# EAGLE schematic bc-module-power (EAGLE 7.7.0)

## Sheet 1 of 2
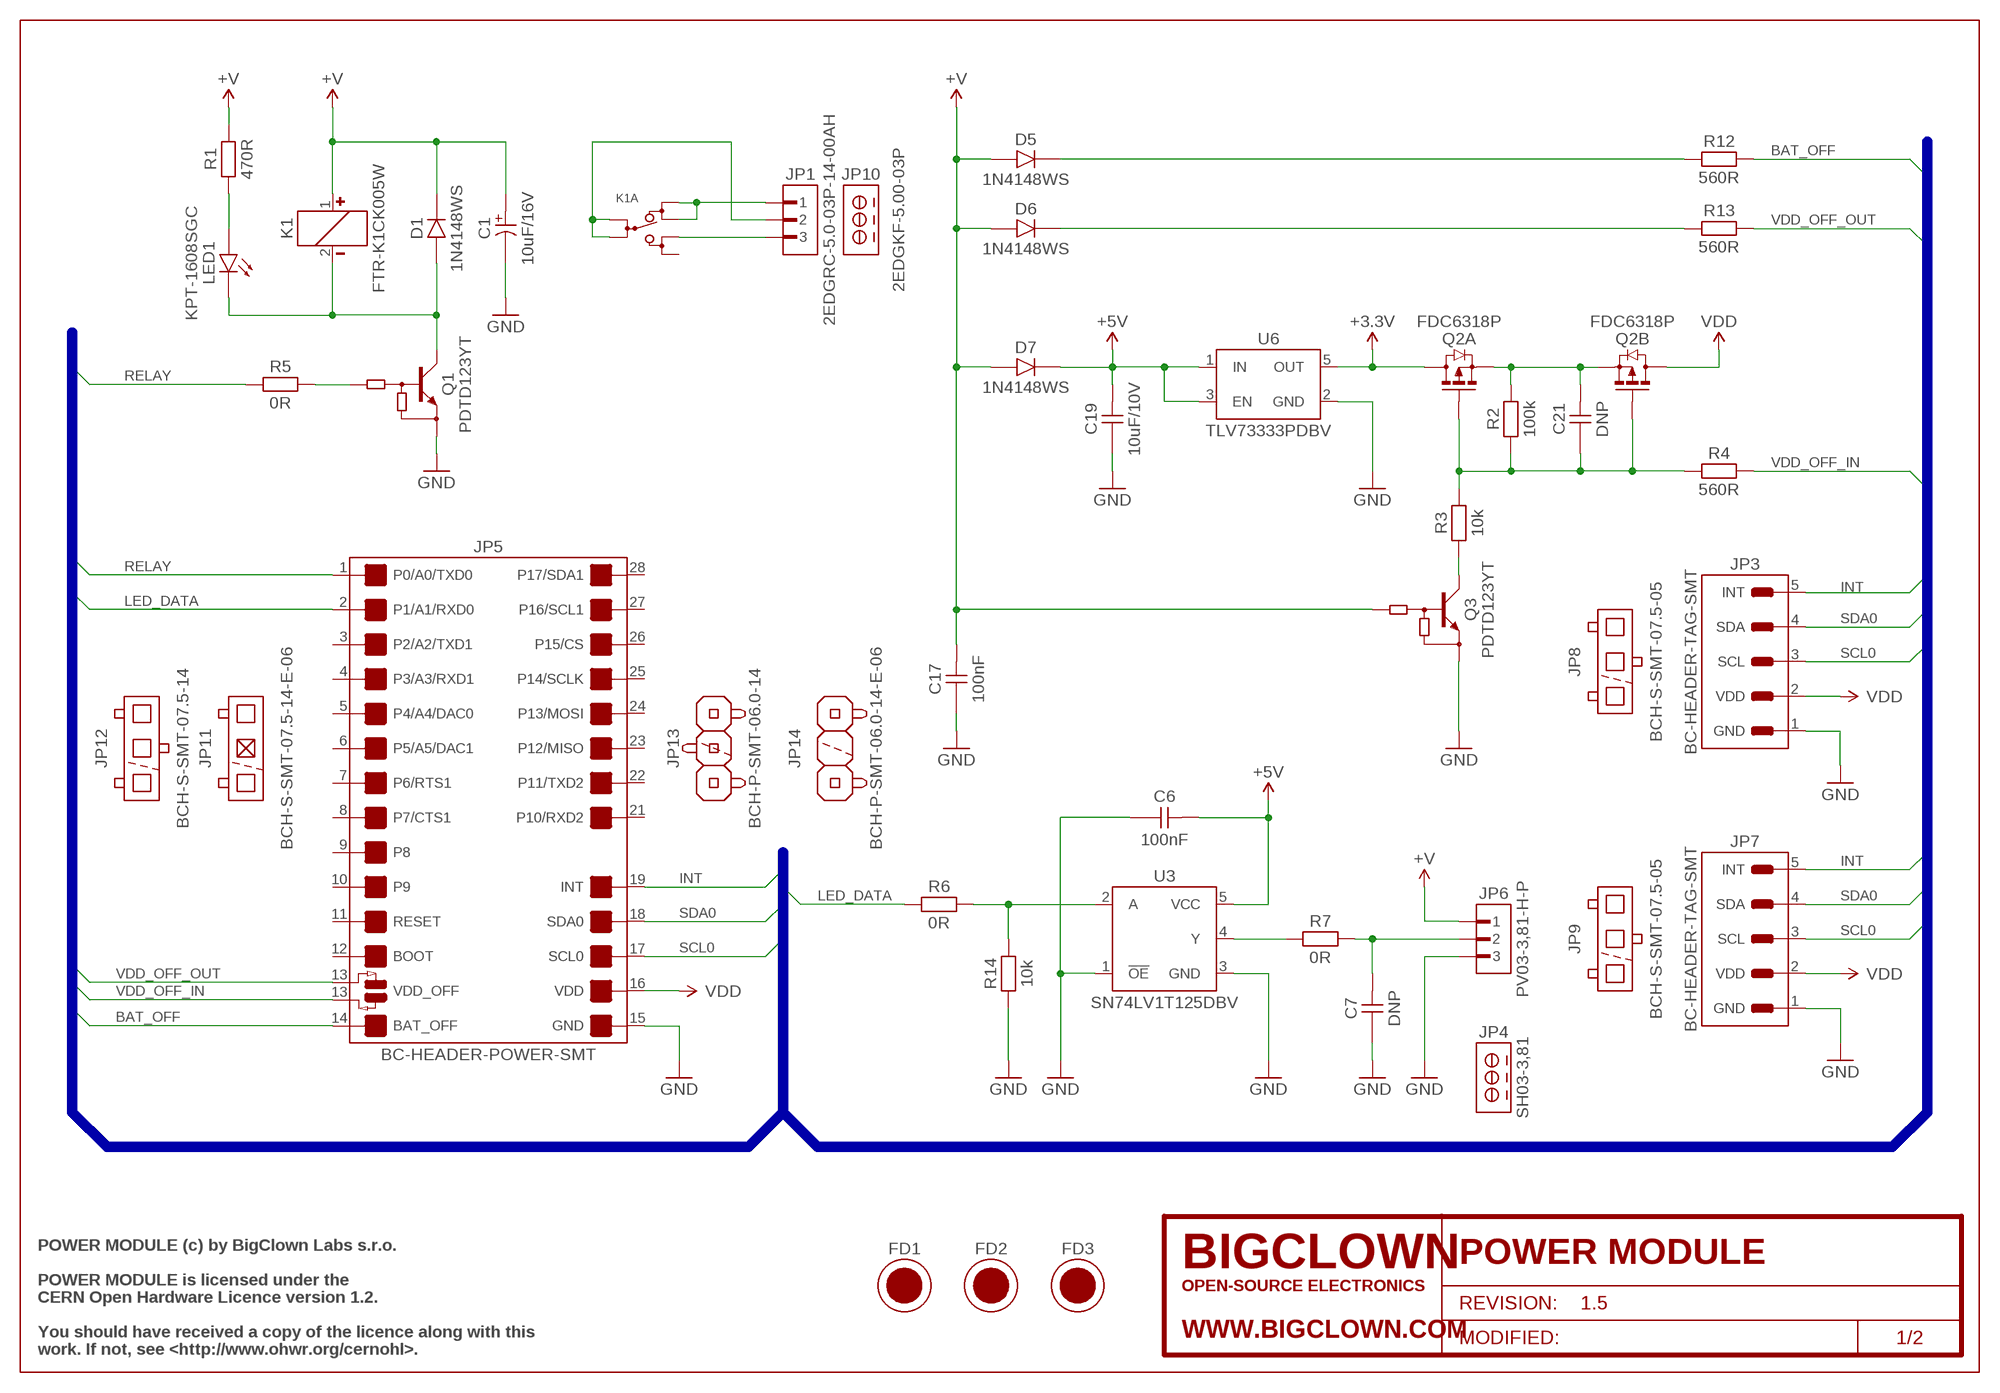
[diagram p0: schematic, sheet 1]
JP4 (JP-SH03-3,81): BCPN: BC-JP-SH03-3,81; VALUE: SH03-3,81
JP10 (JP-2EDGKF-5.00-03P): BCPN: BC-JP-2EDGKF-5.00-03P; VALUE: 2EDGKF-5.00-03P

### Parts
C1  10uF/16V  C-6032-C-10UF-16V  [CAPACITOR-6032-C_R]
C6  100nF  C-0805-100NF  [CAPACITOR-0805_R]
C7  DNP  C-0805-DNP  [CAPACITOR-0805_R]
C17  100nF  C-0805-100NF  [CAPACITOR-0805_R]
C19  10uF/10V  C-0805-10UF-10V  [CAPACITOR-0805_R]
C21  DNP  C-0805-DNP  [CAPACITOR-0805_R]
D1  1N4148WS  D-1N4148WS  [SOD-323_R]
D5  1N4148WS  D-1N4148WS  [SOD-323_R]
D6  1N4148WS  D-1N4148WS  [SOD-323_R]
D7  1N4148WS  D-1N4148WS  [SOD-323_R]
FD1  FIDUCIAL  [FIDUCIAL-1MM]
FD2  FIDUCIAL  [FIDUCIAL-1MM]
FD3  FIDUCIAL  [FIDUCIAL-1MM]
FRAME1  FRAME-SCH/A4L-BRD/A4L  [FRAME-A4L]
JP1  2EDGRC-5.0-03P-14-00AH  JP-2EDGRC-5.0-03P-14-00AH  [2EDGRC-5.0-03P-14-00AH_T]
JP3  BC-HEADER-TAG-SMT  [BC-HEADER-TAG-SMT]
JP5  BC-HEADER-POWER-SMT  [BC-HEADER-POWER-SMT]
JP6  PV03-3,81-H-P  JP-PV03-3,81-H-P  [PV03-3,81-H-P_R]
JP7  BC-HEADER-TAG-SMT  [BC-HEADER-TAG-SMT]
JP8  BCH-S-SMT-07.5-05  JP-BCH-S-SMT-07.5-05  [BCH-S-SMT-05]
JP9  BCH-S-SMT-07.5-05  JP-BCH-S-SMT-07.5-05  [BCH-S-SMT-05]
JP11  BCH-S-SMT-07.5-14-E-06  JP-BCH-S-SMT-07.5-14-E-06  [BCH-S-SMT-14-E-06]
JP12  BCH-S-SMT-07.5-14  JP-BCH-S-SMT-07.5-14  [BCH-S-SMT-14]
JP13  BCH-P-SMT-06.0-14  JP-BCH-P-SMT-06.0-14  [BCH-P-SMT-14]
JP14  BCH-P-SMT-06.0-14-E-06  JP-BCH-P-SMT-06.0-14-E-06  [BCH-P-SMT-14-E-06]
K1  FTR-K1CK005W  K-FTR-K1CK005W  [FTR-K1CK005W_T]
LED1  KPT-1608SGC  LED-KPT-1608SGC  [KPT-1608SGC_R]
Q1  PDTD123YT  Q-PDTD123YT  [SOT-23_R]
Q2  FDC6318P  Q-FDC6318P  [SSOT-6L_R]
Q3  PDTD123YT  Q-PDTD123YT  [SOT-23_R]
R1  470R  R-0805-470R  [RESISTOR-0805_R]
R2  100k  R-0805-100K  [RESISTOR-0805_R]
R3  10k  R-0805-10K  [RESISTOR-0805_R]
R4  560R  R-0805-560R  [RESISTOR-0805_R]
R5  0R  R-0805-0R  [RESISTOR-0805_R]
R6  0R  R-0805-0R  [RESISTOR-0805_R]
R7  0R  R-0805-0R  [RESISTOR-0805_R]
R12  560R  R-0805-560R  [RESISTOR-0805_R]
R13  560R  R-0805-560R  [RESISTOR-0805_R]
R14  10k  R-0805-10K  [RESISTOR-0805_R]
U3  SN74LV1T125DBV  U-SN74LV1T125DBV  [SN74LV1T125DBV_R]
U6  TLV73333PDBV  U-TLV73333PDBV  [TLV73333PDBV_R]

### Nets
+3.3V: Q2.6(A:D) U6.5(OUT)
+5V: C6.1 C19.1 D7.1(C) U3.5(VCC) U6.1(IN) U6.3(EN)
+5V_RECTIFIED_BAT_OFF: D5.1(C) R12.1
+5V_RECTIFIED_VDD_OFF_OUT: D6.1(C) R13.1
+V: C1.A C17.1 D1.1(C) D5.2(A) D6.2(A) D7.2(A) JP6.1 K1.1(K:P) Q3.1(B) R1.2 ; also sheet 2
ANODE: LED1.A R1.1
BAT_OFF: JP5.14(BAT_OFF) R12.2
C: JP1.2 K1.C1(A:C1) K1.C2(A:C2)
GND: C1.C C6.2 C7.2 C17.2 C19.2 JP3.1(GND) JP5.15(GND) JP6.3 JP7.1(GND) Q1.2(E) Q3.2(E) R14.1 U3.1(!OE) U3.3(GND) U6.2(GND) ; also sheet 2
INT: JP3.5(INT) JP5.19(INT) JP7.5(INT)
LED_DATA: JP5.2(P1/A1/RXD0) R6.1
LED_DATA_BUFFERED: R7.1 U3.4(Y)
LED_DATA_FILTERED: C7.1 JP6.2 R7.2
LED_DATA_INPUT: R6.2 R14.2 U3.2(A)
NC: JP1.1 K1.NC1(A:NC1) K1.NC2(A:NC2)
NO: JP1.3 K1.NO1(A:NO1)
Q1_B: Q1.1(B) R5.2
RELAY: JP5.1(P0/A0/TXD0) R5.1
RELAY_MINUS: D1.2(A) K1.2(K:M) LED1.C Q1.3(C)
SCL0: JP3.3(SCL) JP5.17(SCL0) JP7.3(SCL)
SDA0: JP3.4(SDA) JP5.18(SDA0) JP7.4(SDA)
VDD: JP3.2(VDD) JP5.16(VDD) JP7.2(VDD) Q2.4(B:D)
VDD_OFF_IN: JP5.13B(VDD_OFF_OUT) R4.2
VDD_OFF_IN_C: Q3.3(C) R3.1
VDD_OFF_IN_G: C21.2 Q2.1(A:G) Q2.3(B:G) R2.1 R3.2 R4.1
VDD_OFF_OUT: JP5.13T(VDD_OFF_IN) R13.2
VDD_S: C21.1 Q2.2(B:S) Q2.5(A:S) R2.2
Unconnected: JP5.3(P2/A2/TXD1) JP5.4(P3/A3/RXD1) JP5.5(P4/A4/DAC0) JP5.6(P5/A5/DAC1) JP5.7(P6/RTS1) JP5.8(P7/CTS1) JP5.9(P8) JP5.10(P9) JP5.11(RESET) JP5.12(BOOT) JP5.21(P10/RXD2) JP5.22(P11/TXD2) JP5.23(P12/MISO) JP5.24(P13/MOSI) JP5.25(P14/SCLK) JP5.26(P15/CS) JP5.27(P16/SCL1) JP5.28(P17/SDA1) K1.NO2(A:NO2)

### Buses
VDD_OFF_OUT,VDD_OFF_IN,BAT_OFF,LED_DATA,RELAY,SDA0,SCL0,INT

### Notes on the sheet
- POWER MODULE (c) by BigClown Labs s.r.o.
- POWER MODULE is licensed under the
- CERN Open Hardware Licence version 1.2.
- You should have received a copy of the licence along with this
- work. If not, see <http://www.ohwr.org/cernohl>.

## Sheet 2 of 2
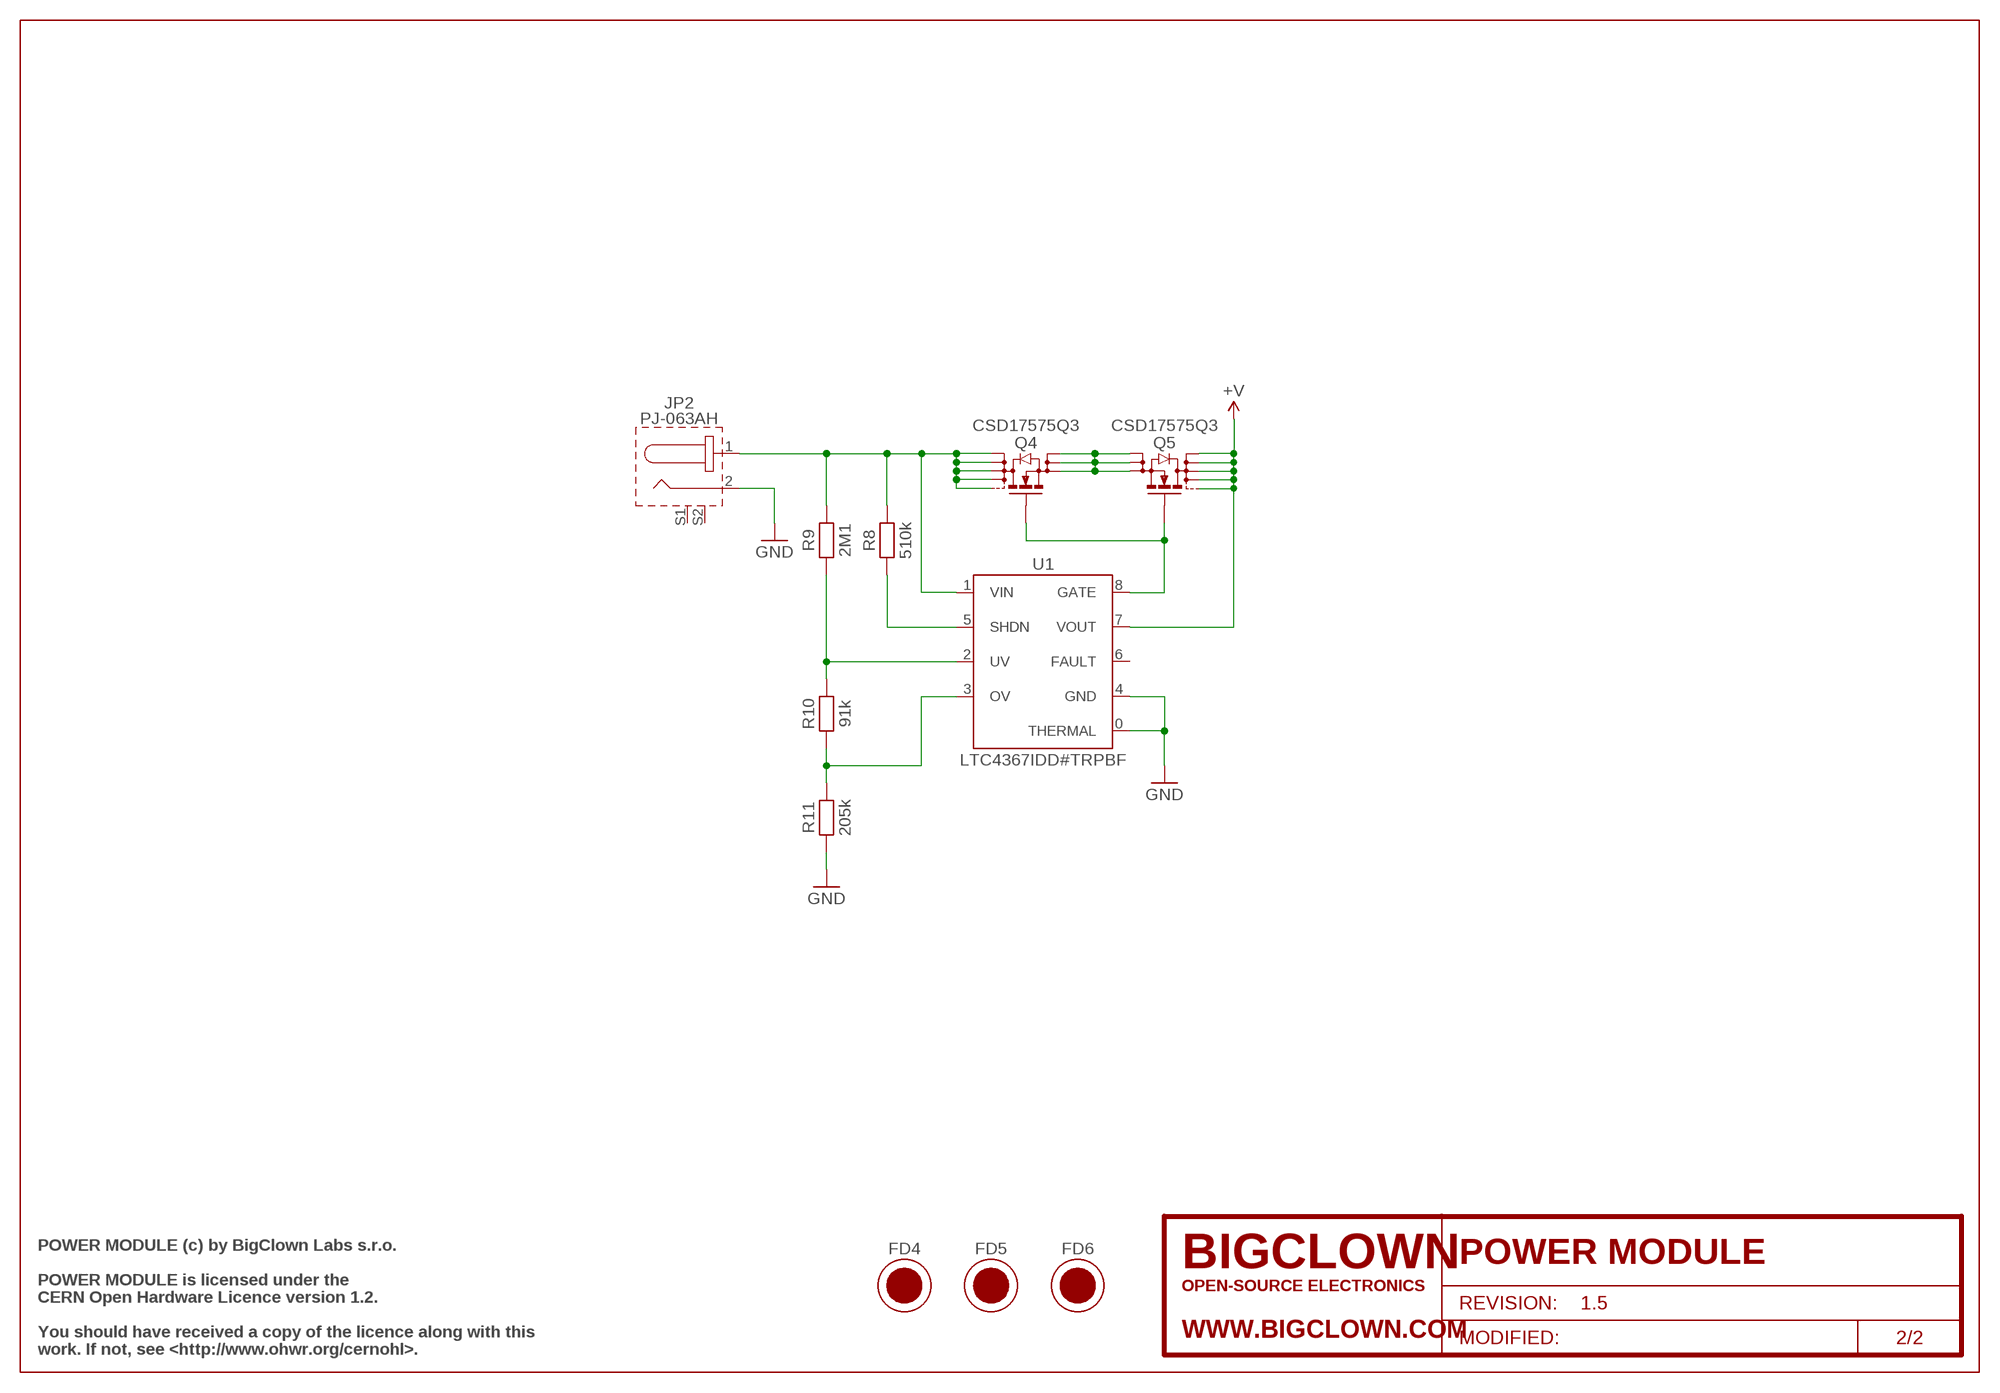
[diagram p1: schematic, sheet 2]
FRAME2 (FRAME-SCH/A4L-BRD/NONE): BCPN: -; PROJECT_NAME: POWER MODULE; PROJECT_REVISION: 1.5

### Parts
FD4  FIDUCIAL  [FIDUCIAL-1MM]
FD5  FIDUCIAL  [FIDUCIAL-1MM]
FD6  FIDUCIAL  [FIDUCIAL-1MM]
JP2  PJ-063AH  JP-PJ-063AH  [PJ-063AH]
Q4  CSD17575Q3  Q-CSD17575Q3  [CSD17575Q3_R]
Q5  CSD17575Q3  Q-CSD17575Q3  [CSD17575Q3_R]
R8  510k  R-0402-510K  [RESISTOR-0402_R]
R9  2M1  R-0402-2M1  [RESISTOR-0402_R]
R10  91k  R-0402-91K  [RESISTOR-0402_R]
R11  205k  R-0402-205K  [RESISTOR-0402_R]
U1  LTC4367IDD#TRPBF  U-LTC4367IDD#TRPBF  [LTC4367IDD#TRPBF_R]

### Nets
+V: Q5.0(D0) Q5.5(D1) Q5.6(D2) Q5.7(D3) Q5.8(D4) U1.7(VOUT) ; also sheet 1
GATE: Q4.4(G) Q5.4(G) U1.8(GATE)
GND: JP2.2 R11.1 U1.0(THERMAL) U1.4(GND) ; also sheet 1
OV: R10.1 R11.2 U1.3(OV)
SHDN: R8.1 U1.5(SHDN)
SOURCE: Q4.1(S1) Q4.2(S2) Q4.3(S3) Q5.1(S1) Q5.2(S2) Q5.3(S3)
UV: R9.1 R10.2 U1.2(UV)
VIN: JP2.1 Q4.0(D0) Q4.5(D1) Q4.6(D2) Q4.7(D3) Q4.8(D4) R8.2 R9.2 U1.1(VIN)
Unconnected: JP2.S1 JP2.S2 U1.6(FAULT)

### Notes on the sheet
- POWER MODULE (c) by BigClown Labs s.r.o.
- POWER MODULE is licensed under the
- CERN Open Hardware Licence version 1.2.
- You should have received a copy of the licence along with this
- work. If not, see <http://www.ohwr.org/cernohl>.

## Library data of the parts
C1 = bc-capacitor:C-6032-C-10UF-16V; BCPN: BC-C-6032-C-10UF-16V
C6 C17 = bc-capacitor:C-0805-100NF; BCPN: BC-C-0805-100NF
C7 C21 = bc-capacitor:C-0805-DNP; BCPN: -
C19 = bc-capacitor:C-0805-10UF-10V; BCPN: BC-C-0805-10UF-10V
D1 D5-D7 = bc-discrete:D-1N4148WS; BCPN: BC-D-1N4148WS
FD1-FD6 = bc-fiducial:FIDUCIAL; BCPN: -
FRAME1 = bc-frame:FRAME-SCH/A4L-BRD/A4L; BCPN: -; PROJECT_NAME: POWER MODULE; PROJECT_REVISION: 1.5
JP1 = bc-connector:JP-2EDGRC-5.0-03P-14-00AH; BCPN: BC-JP-2EDGRC-5.0-03P-14-00AH
JP2 = bc-connector:JP-PJ-063AH; BCPN: BC-JP-PJ-063AH
JP3 JP7 = bc-header:BC-HEADER-TAG-SMT; BCPN: -
JP5 = bc-header:BC-HEADER-POWER-SMT; BCPN: -
JP6 = bc-connector:JP-PV03-3,81-H-P; BCPN: BC-JP-PV03-3,81-H-P
JP8 JP9 = bc-header:JP-BCH-S-SMT-07.5-05; BCPN: BC-JP-BCH-S-SMT-07.5-05
JP11 = bc-header:JP-BCH-S-SMT-07.5-14-E-06; BCPN: BC-JP-BCH-S-SMT-07.5-14-E-06
JP12 = bc-header:JP-BCH-S-SMT-07.5-14; BCPN: BC-JP-BCH-S-SMT-07.5-14
JP13 = bc-header:JP-BCH-P-SMT-06.0-14; BCPN: BC-JP-BCH-P-SMT-06.0-14
JP14 = bc-header:JP-BCH-P-SMT-06.0-14-E-06; BCPN: BC-JP-BCH-P-SMT-06.0-14-E-06
K1 = bc-relay:K-FTR-K1CK005W; BCPN: BC-K-FTR-K1CK005W
LED1 = bc-led:LED-KPT-1608SGC; BCPN: BC-LED-KPT-1608SGC
Q1 Q3 = bc-discrete:Q-PDTD123YT; BCPN: BC-Q-PDTD123YT
Q2 = bc-discrete:Q-FDC6318P; BCPN: BC-Q-FDC6318P
Q4 Q5 = bc-discrete:Q-CSD17575Q3; BCPN: BC-Q-CSD17575Q3
R1 = bc-resistor:R-0805-470R; BCPN: BC-R-0805-470R
R2 = bc-resistor:R-0805-100K; BCPN: BC-R-0805-100K
R3 R14 = bc-resistor:R-0805-10K; BCPN: BC-R-0805-10K
R4 R12 R13 = bc-resistor:R-0805-560R; BCPN: BC-R-0805-560R
R5-R7 = bc-resistor:R-0805-0R; BCPN: BC-R-0805-0R
R8 = bc-resistor:R-0402-510K; BCPN: BC-R-0402-510K
R9 = bc-resistor:R-0402-2M1; BCPN: BC-R-0402-2M1
R10 = bc-resistor:R-0402-91K; BCPN: BC-R-0402-91k
R11 = bc-resistor:R-0402-205K; BCPN: BC-R-0402-205K
U1 = bc-protection:U-LTC4367IDD#TRPBF; BCPN: BC-U-LTC4367IDD#TRPBF
U3 = bc-logic:U-SN74LV1T125DBV; BCPN: BC-U-SN74LV1T125DBV
U6 = bc-power:U-TLV73333PDBV; BCPN: BC-U-TLV73333PDBV